# Altium schematic sheet FPGA_Core_Module.SchDoc: FPGA Core Module
size A4
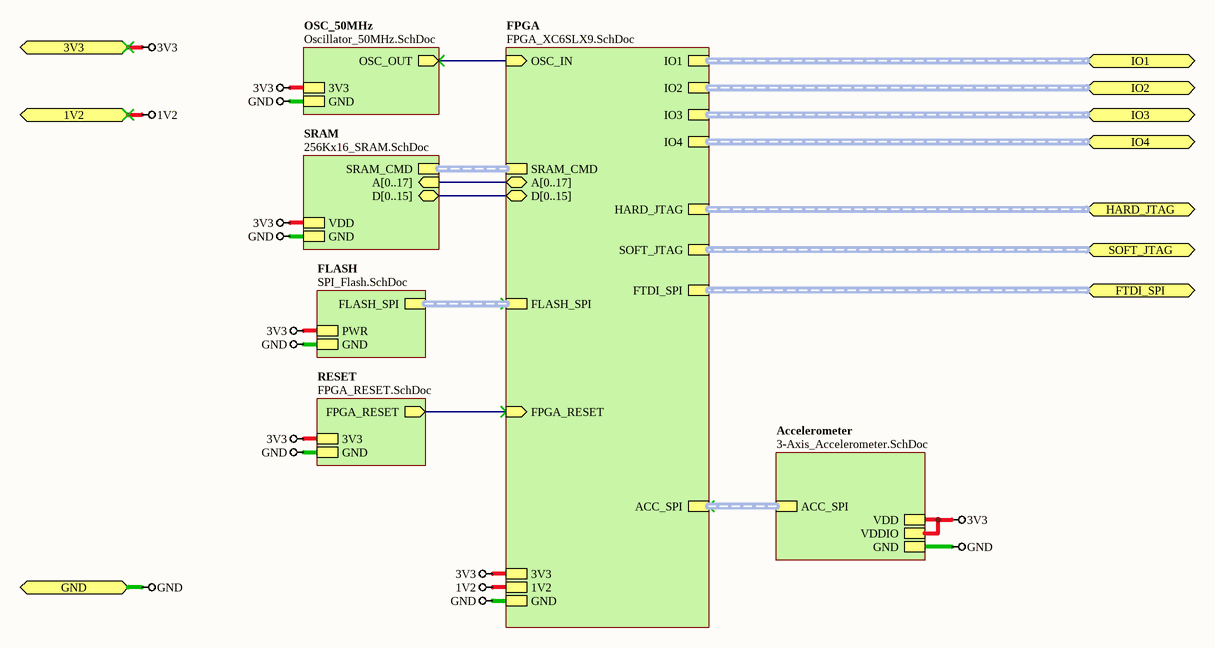
[diagram p0: FPGA_Core_Module.SchDoc]

## Sub-sheets
Accelerometer = 3-Axis_Accelerometer.SchDoc: VDD, VDDIO, GND, ACC_SPI (harness ACC_SPI)
FLASH = SPI_Flash.SchDoc: FLASH_SPI (harness FLASH_SPI), PWR, GND
FPGA = FPGA_XC6SLX9.SchDoc: SRAM_CMD (harness SRAM_CMD), A[0..17] (bidir), D[0..15] (bidir), IO1 (harness SIG8), 3V3, GND, 1V2, OSC_IN (in), FPGA_RESET (in), IO2 (harness SIG4), IO3 (harness SIG20), HARD_JTAG (harness JTAG_A), SOFT_JTAG (harness JTAG_A), FTDI_SPI (harness FTDI_SPI), IO4 (harness SIG10), ACC_SPI (harness ACC_SPI), FLASH_SPI (harness FLASH_SPI)
OSC_50MHz = Oscillator_50MHz.SchDoc: 3V3, OSC_OUT (out), GND
RESET = FPGA_RESET.SchDoc: FPGA_RESET (out), GND, 3V3
SRAM = 256Kx16_SRAM.SchDoc: GND, VDD, A[0..17] (in), D[0..15] (bidir), SRAM_CMD (harness SRAM_CMD)

## Ports
1V2, 3V3, FTDI_SPI (harness FTDI_SPI), GND, HARD_JTAG (harness JTAG_A), IO1 (harness SIG8), IO2 (harness SIG4), IO3 (harness SIG20), IO4 (harness SIG10), SOFT_JTAG (harness JTAG_A)

## Nets
1V2: port 1V2, sheet FPGA/1V2
3V3: port 3V3, sheet RESET/3V3, sheet SRAM/VDD, sheet OSC_50MHz/3V3, sheet FLASH/PWR, sheet Accelerometer/VDD, sheet Accelerometer/VDDIO, sheet FPGA/3V3
GND: port GND, sheet RESET/GND, sheet SRAM/GND, sheet OSC_50MHz/GND, sheet FLASH/GND, sheet Accelerometer/GND, sheet FPGA/GND
(unnamed): sheet RESET/FPGA_RESET, sheet FPGA/FPGA_RESET
(unnamed): sheet OSC_50MHz/OSC_OUT, sheet FPGA/OSC_IN

## Buses and harness runs
bus sheet FPGA/A[0..17] = sheet SRAM/A[0..17]
bus sheet FPGA/D[0..15] = sheet SRAM/D[0..15]
harness port FTDI_SPI = sheet FPGA/FTDI_SPI
harness port HARD_JTAG = sheet FPGA/HARD_JTAG
harness port IO1 = sheet FPGA/IO1
harness port IO2 = sheet FPGA/IO2
harness port IO3 = sheet FPGA/IO3
harness port IO4 = sheet FPGA/IO4
harness port SOFT_JTAG = sheet FPGA/SOFT_JTAG
harness sheet Accelerometer/ACC_SPI = sheet FPGA/ACC_SPI
harness sheet FLASH/FLASH_SPI = sheet FPGA/FLASH_SPI
harness sheet FPGA/SRAM_CMD = sheet SRAM/SRAM_CMD

## Notes on the sheet
- Sheet Title
- Project Title
- Size:
- Date:
- A4
- Item:
- Time:
- Revision:
- Sheet
- of
- File: